# Altium schematic sheet dcdc.schdoc
size 209 x 297 mm; PageSetup: Record=PageOptions|CenterHorizontal=False|CenterVertical=False|PrintScale=0.95|XCorrection=0.00|YCorrection=0.00|PrintKind=1|BorderSize=5000000|LeftOffset=0|BottomOffset=0|Orientation=1|PaperLength=1000|PaperWidth=1000|Scale=100|PaperSource=15|PrintQuality=600|MediaType=1|DitherType=10|PaperKind=A4|PrintScaleMode=1
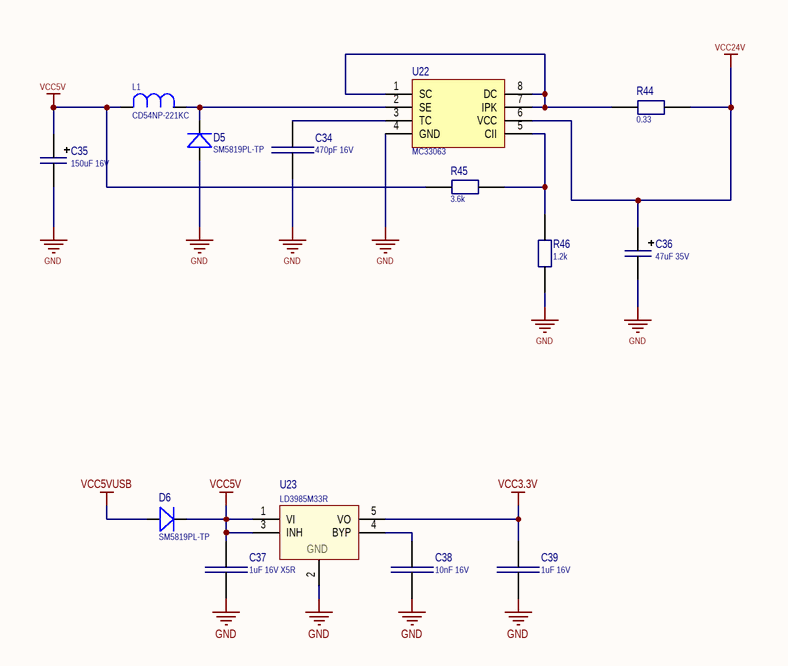
[diagram p0: dcdc.schdoc]

## Parts
C34  470pF 16V  [C_0603]
C35  150uF 16V  [TANTAL_TYPE_D]
C36  47uF 35V  [TANTAL_TYPE_X]
C37  1uF 16V X5R  [C_0603]
C38  10nF 16V  [C_0603]
C39  1uF 16V  [C_0603]
D5  SM5819PL-TP  [SOD-123]
D6  SM5819PL-TP  [SOD-123]
L1  CD54NP-221KC  [CD54NP]
R44  0.33  [R_1206]
R45  3.6k  [R_0603]
R46  1.2k  [R_0603]
U22  MC33063  [SO-8]
U23  LD3985M33R  [SOT23-5]

## Nets
GND: C34.1 C35.2 C36.2 C37.1 C38.1 C39.1 D5.1(A) R46.1 U22.4(GND) U23.2(GND)
VCC3.3V: C39.2 U23.5(VO)
VCC5V: C35.1 C37.2 D6.2(K) L1.2 R45.1 U23.1(VI) U23.3(INH)
VCC5VUSB: D6.1(A)
VCC24V: C36.1 R44.1 U22.6(VCC)
NetC34_2: C34.2 U22.3(TC)
NetC38_2: C38.2 U23.4(BYP)
NetD5_2: D5.2(K) L1.1 U22.2(SE)
NetR44_2: R44.2 U22.1(SC) U22.7(IPK) U22.8(DC)
NetR45_2: R45.2 R46.2 U22.5(CII)

## Library data of the parts
C34 = C0603: Capacitor; Part Number: CC0603KRX7R9BB471; Value: 470pF 16V
C35 = TANTAL_CAP: Tantal Capacitor; Part Number: T491D157K016AT; Alternative Part: *; Value: 150uF 16V
C36 = TANTAL_CAP: Tantal Capacitor; Part Number: T491X476K035AT; Alternative Part: *; Value: 47uF 35V
C37 C39 = C0603: Capacitor; Part Number: CC0603KRX7R7BB105
  C37: Value: 1uF 16V X5R
  C39: Value: 1uF 16V
C38 = C0603: Capacitor; Part Number: CC0603JRX7R7BB103; Value: 10nF 16V
D5 D6 = D_SOD123: Diode; Part Number: SM5819PL-TP
L1 = L_CD54NP: Inductor; Value: CD54NP-221KC; Part Number: CD54NP-221KC
R44 = RES_SMD: Resistor; Part Number: RL1206FR-070R33L; Alternative Part: *; Value: 0.33
R45 = RES_SMD: Resistor; Part Number: RC0603FR-073K6L; Alternative Part: *; Value: 3.6k
R46 = RES_SMD: Resistor; Part Number: RC0603FR-071K2L; Alternative Part: *; Value: 1.2k
U22 = MC33063: Step-up/down IC; Part Number: MC33063; Alternativr Part: *
U23 = LD3985M33R: Part Number: LD3985M33R; Alternative Part: *